# EAGLE design Atari ST 4MB RAM (EAGLE 7.7.0)
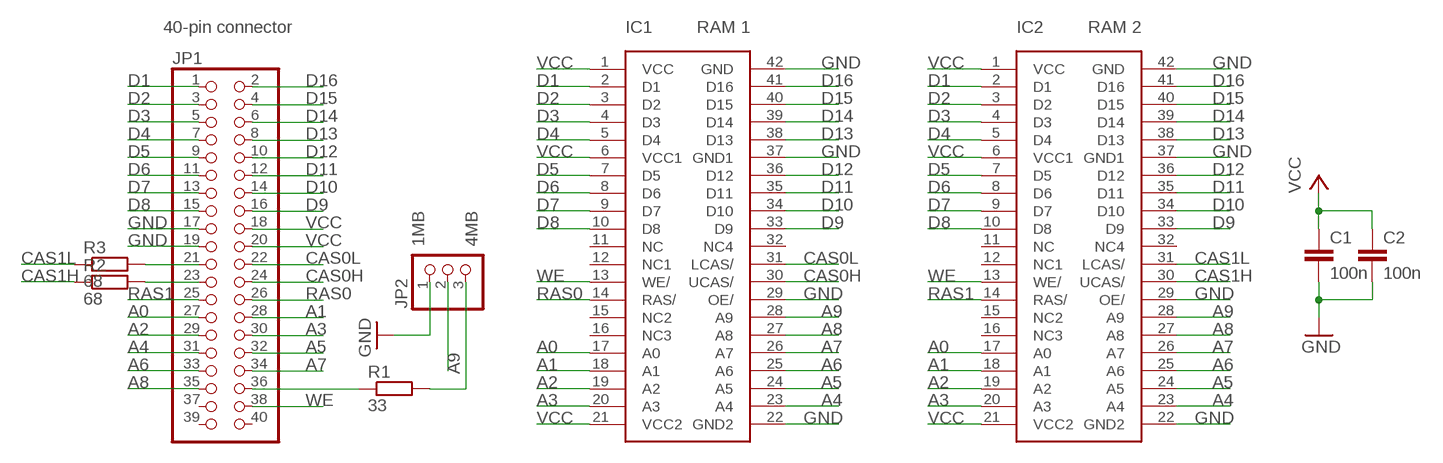
[diagram p0: schematic, sheet 1]

## Parts
C1  100n  C-EUC0805  [C0805]
C2  100n  C-EUC0805  [C0805]
IC1  DRAMSOJ40A  [SOJ40]
IC2  DRAMSOJ40A  [SOJ40]
JP1  PINHD-2X20  [2X20]
JP2  PINHD-1X3  [1X03]
R1  33  R-EU_R0805  [R0805]
R2  68  R-EU_R0805  [R0805]
R3  68  R-EU_R0805  [R0805]

## Nets
A0: IC1.17(A0) IC2.17(A0) JP1.27
A1: IC1.18(A1) IC2.18(A1) JP1.28
A2: IC1.19(A2) IC2.19(A2) JP1.29
A3: IC1.20(A3) IC2.20(A3) JP1.30
A4: IC1.23(A4) IC2.23(A4) JP1.31
A5: IC1.24(A5) IC2.24(A5) JP1.32
A6: IC1.25(A6) IC2.25(A6) JP1.33
A7: IC1.26(A7) IC2.26(A7) JP1.34
A8: IC1.27(A8) IC2.27(A8) JP1.35
A9: IC1.28(A9) IC2.28(A9) JP2.2
CAS0H: IC1.30(UCAS/) JP1.24
CAS0L: IC1.31(LCAS/) JP1.22
CAS1H: IC2.30(UCAS/) R2.1
CAS1L: IC2.31(LCAS/) R3.1
D1: IC1.2(D1) IC2.2(D1) JP1.1
D2: IC1.3(D2) IC2.3(D2) JP1.3
D3: IC1.4(D3) IC2.4(D3) JP1.5
D4: IC1.5(D4) IC2.5(D4) JP1.7
D5: IC1.7(D5) IC2.7(D5) JP1.9
D6: IC1.8(D6) IC2.8(D6) JP1.11
D7: IC1.9(D7) IC2.9(D7) JP1.13
D8: IC1.10(D8) IC2.10(D8) JP1.15
D9: IC1.33(D9) IC2.33(D9) JP1.16
D10: IC1.34(D10) IC2.34(D10) JP1.14
D11: IC1.35(D11) IC2.35(D11) JP1.12
D12: IC1.36(D12) IC2.36(D12) JP1.10
D13: IC1.38(D13) IC2.38(D13) JP1.8
D14: IC1.39(D14) IC2.39(D14) JP1.6
D15: IC1.40(D15) IC2.40(D15) JP1.4
D16: IC1.41(D16) IC2.41(D16) JP1.2
GND: C1.2 C2.2 IC1.22(GND2) IC1.29(OE/) IC1.37(GND1) IC1.42(GND) IC2.22(GND2) IC2.29(OE/) IC2.37(GND1) IC2.42(GND) JP1.17 JP1.19 JP2.1
N$1: JP1.21 R3.2
N$2: JP1.23 R2.2
N$3: JP1.36 R1.1
N$4: JP2.3 R1.2
RAS0: IC1.14(RAS/) JP1.26
RAS1: IC2.14(RAS/) JP1.25
VCC: C1.1 C2.1 IC1.1(VCC) IC1.6(VCC1) IC1.21(VCC2) IC2.1(VCC) IC2.6(VCC1) IC2.21(VCC2) JP1.18 JP1.20
WE: IC1.13(WE/) IC2.13(WE/) JP1.38
Unconnected: IC1.11(NC) IC1.12(NC1) IC1.15(NC2) IC1.16(NC3) IC1.32(NC4) IC2.11(NC) IC2.12(NC1) IC2.15(NC2) IC2.16(NC3) IC2.32(NC4) JP1.37 JP1.39 JP1.40

## Notes on the sheet
- 40-pin connector | RAM 1 | RAM 2
- 1MB | 4MB

## Library data of the parts
C1 C2 = rcl:C-EU: CAPACITOR, European symbol
IC1 IC2 = memory-soj42:DRAMSOJ40A: MEMORY; OC_FARNELL: unknown; OC_NEWARK: unknown
JP1 = pinhead:PINHD-2X20: PIN HEADER
JP2 = pinhead:PINHD-1X3: PIN HEADER
R1-R3 = rcl:R-EU_: RESISTOR, European symbol

## Board
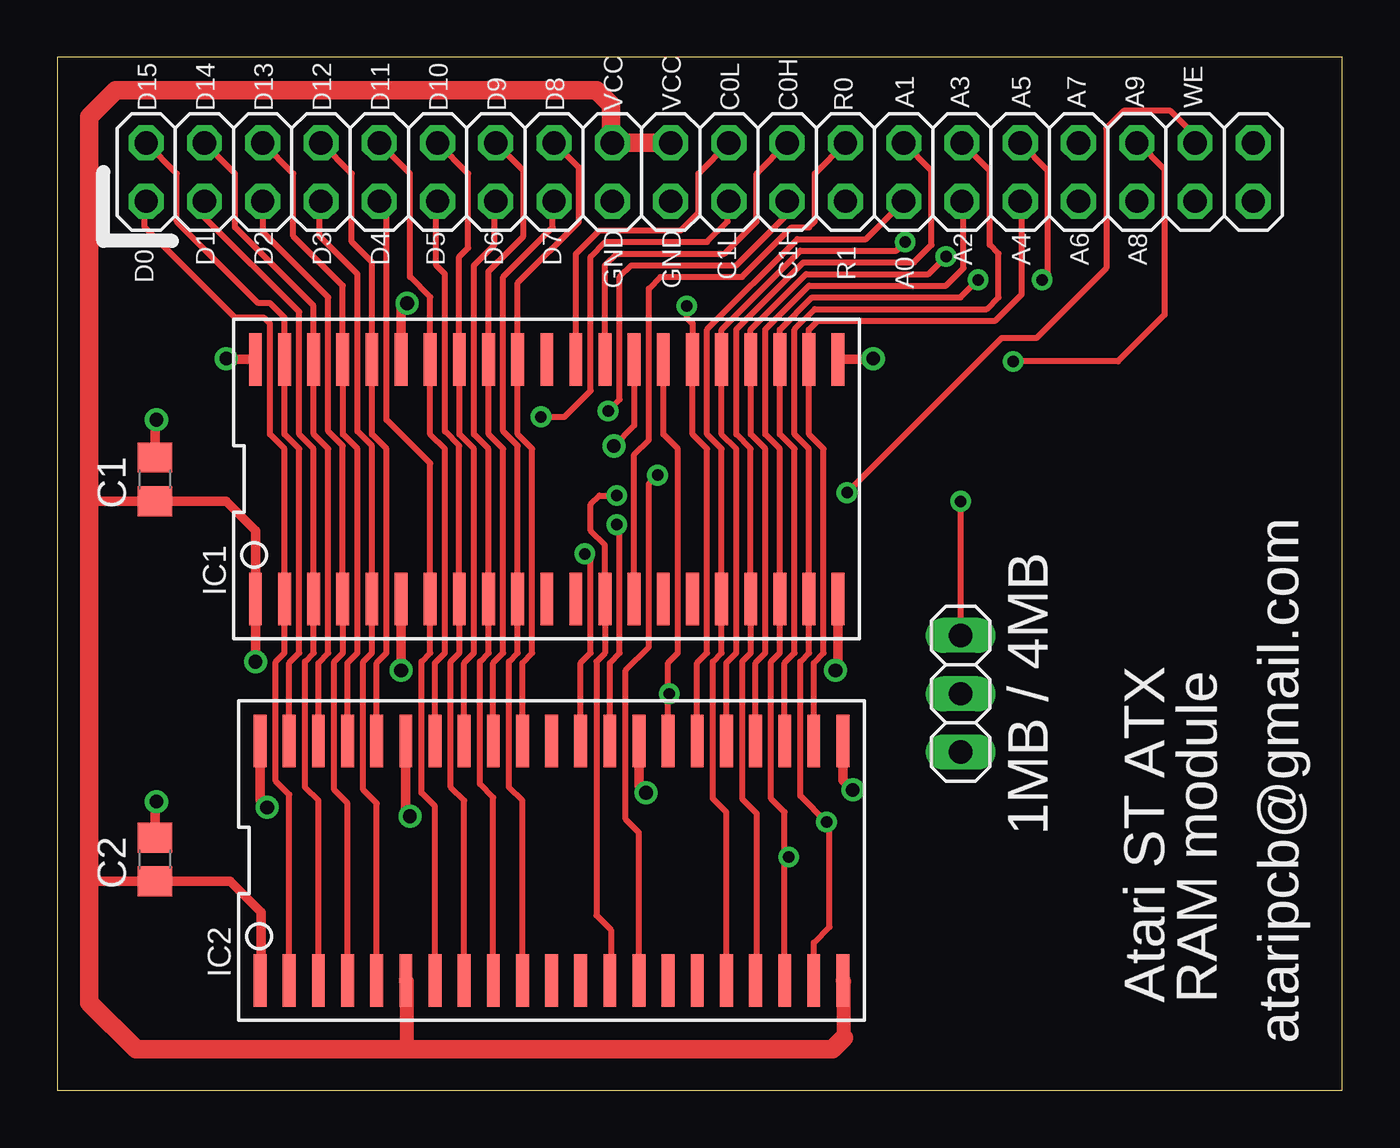
[diagram p1: board, top side]
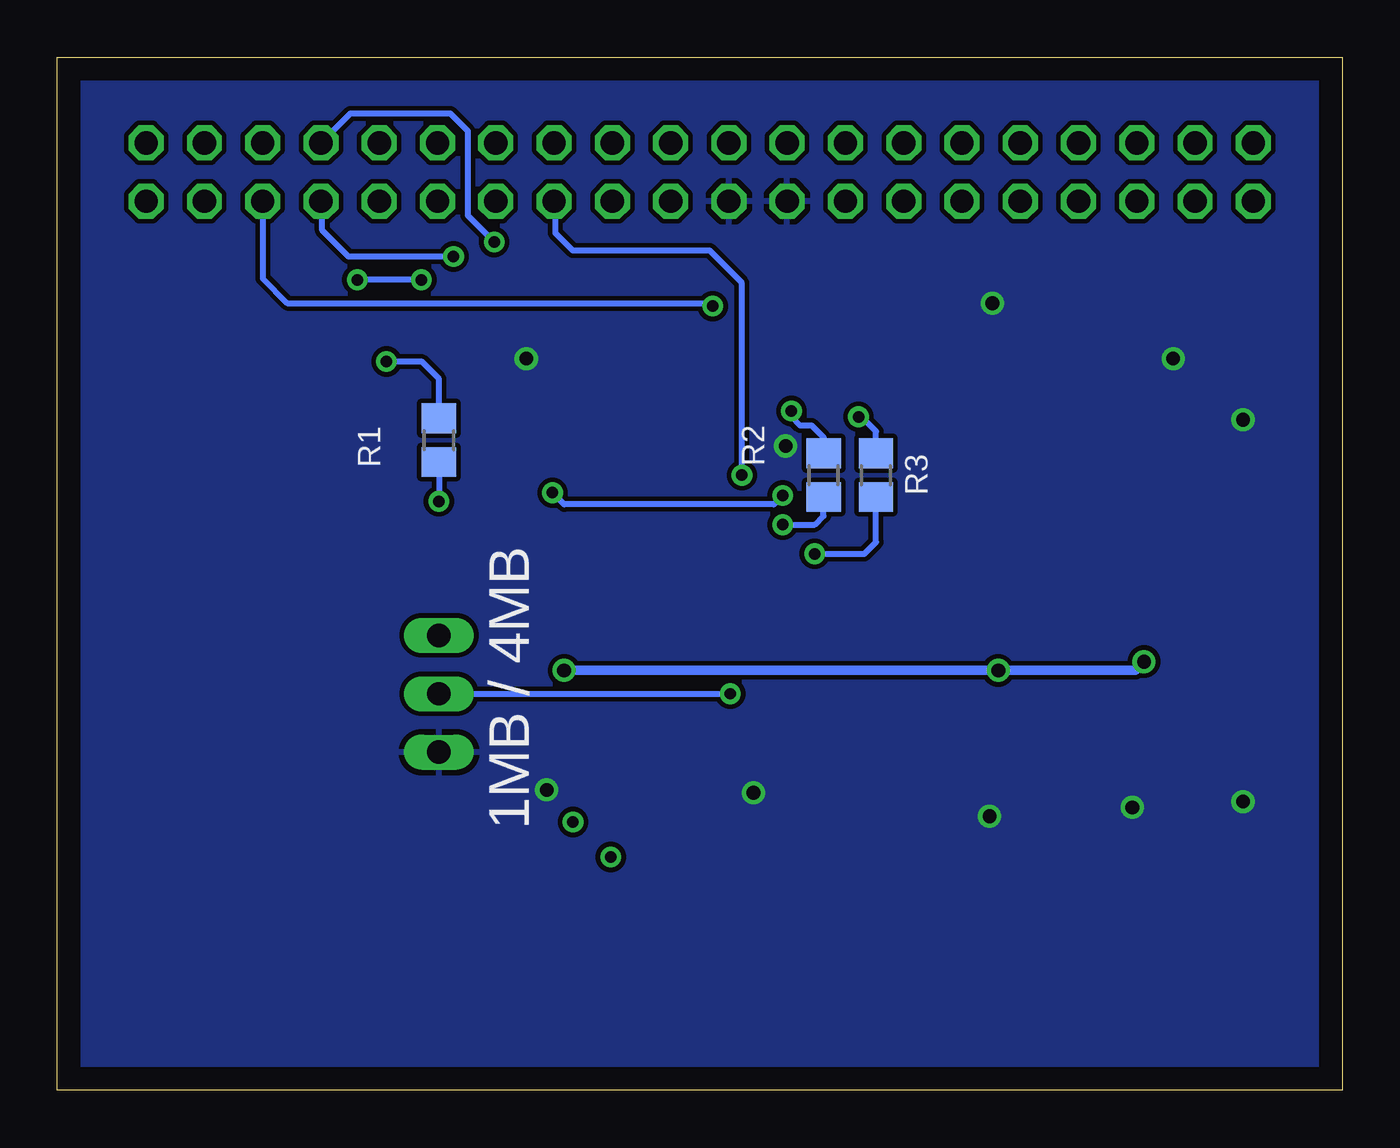
[diagram p2: board, bottom side, seen from below]

Size 56 x 45 mm. Coordinates in mm from the lower left corner, seen from the top.
Outline: 0,0 56,0 56,45 0,45 0,0
Copper layers (1*16): Top 0.035mm / dielectric 1.5mm / Bottom 0.035mm
Design rules "default": minimum track width 10mil, minimum drill 24mil, track to track 8mil, track to pad 8mil, pad to pad 8mil, via to via 8mil, smd to smd 8mil, copper to edge 40mil, drill to drill 8mil, minimum pad ring 10mil, minimum via ring 8mil, stop-mask expansion 4mil, vias tented up to drill 0mil, thermal gap 10mil

### Footprints (pad centres in the part's own frame; a part is rotated, then mirrored left to right if it is on the bottom)
C0805 = smd 1.3 x 1.5: 1 -0.95,0; 2 0.95,0
SOJ40 = smd 0.559 x 2.286: 1 -10.16,-5.22; 2 -8.89,-5.22; 3 -7.62,-5.22; 4 -6.35,-5.22; 5 -5.08,-5.22; 6 -3.81,-5.22; 7 -2.54,-5.22; 8 -1.27,-5.22; 9 0,-5.22; 10 1.27,-5.22; 11 2.54,-5.22; 12 3.81,-5.22; 13 5.08,-5.22; 14 6.35,-5.22; 15 7.62,-5.22; 16 8.89,-5.22; 17 10.16,-5.22; 18 11.43,-5.22; 19 12.7,-5.22; 20 13.97,-5.22; 21 15.24,-5.22; 22 15.24,5.22; 23 13.97,5.22; 24 12.7,5.22; 25 11.43,5.22; 26 10.16,5.22; 27 8.89,5.22; 28 7.62,5.22; 29 6.35,5.22; 30 5.08,5.22; 31 3.81,5.22; 32 2.54,5.22; 33 1.27,5.22; 34 0,5.22; 35 -1.27,5.22; 36 -2.54,5.22; 37 -3.81,5.22; 38 -5.08,5.22; 39 -6.35,5.22; 40 -7.62,5.22; 41 -8.89,5.22; 42 -10.16,5.22
2X20 = drill 1.016 octagon: 1 -24.13,-1.27; 2 -24.13,1.27; 3 -21.59,-1.27; 4 -21.59,1.27; 5 -19.05,-1.27; 6 -19.05,1.27; 7 -16.51,-1.27; 8 -16.51,1.27; 9 -13.97,-1.27; 10 -13.97,1.27; 11 -11.43,-1.27; 12 -11.43,1.27; 13 -8.89,-1.27; 14 -8.89,1.27; 15 -6.35,-1.27; 16 -6.35,1.27; 17 -3.81,-1.27; 18 -3.81,1.27; 19 -1.27,-1.27; 20 -1.27,1.27; 21 1.27,-1.27; 22 1.27,1.27; 23 3.81,-1.27; 24 3.81,1.27; 25 6.35,-1.27; 26 6.35,1.27; 27 8.89,-1.27; 28 8.89,1.27; 29 11.43,-1.27; 30 11.43,1.27; 31 13.97,-1.27; 32 13.97,1.27; 33 16.51,-1.27; 34 16.51,1.27; 35 19.05,-1.27; 36 19.05,1.27; 37 21.59,-1.27; 38 21.59,1.27; 39 24.13,-1.27; 40 24.13,1.27
1X03 = drill 1.016 long: 1 -2.54,0; 2 0,0; 3 2.54,0
R0805 = smd 1.3 x 1.5: 1 -0.95,0; 2 0.95,0

### Placement (x,y rotation side)
C1  4.26,26.61 90 top
C2  4.26,10.05 90 top
IC1  18.79,26.62 0 top
IC2  19,10 0 top
JP1  28,40 0 top
JP2  39.37,17.27 90 top
R1  39.37,28.32 270 bottom
R2  22.61,26.8 90 bottom
R3  20.32,26.8 90 bottom

### Tracks (layer width: path | path; a pad name or v marks a point on that pad's centre or on a via)
A0
  Top 0.254: IC2.17 29.16,12.12 28.57,12.7 28.57,18.67 28.96,19.05 IC1.17 28.95,27.95 28.32,28.57 28.32,33.15 32.26,37.08 35.24,37.08 JP1.27
A1
  Top 0.254: JP1.28 38.1,40.06 38.1,36.83 37.34,36.07 32.51,36.07 29.59,33.15 29.59,28.57 30.22,27.95 IC1.18 30.22,19.04 29.84,18.67 29.84,12.7 30.48,12.06 30.48,4.83 IC2.18
A2  (via drill 0.5)
  Top 0.254: IC2.19 31.7,10.16 | 31.7,10.16 31.7,12.12 31.11,12.7 31.11,18.67 31.5,19.05 IC1.19 31.49,27.95 30.86,28.57 30.86,33.15 32.77,35.05 38.73,35.05 39.5,35.81 39.5,38.66 JP1.29 | v31.88,10.16 31.7,10.16
A3  (via drill 0.5)
  Top 0.254: IC2.20 32.97,6.43 33.66,7.11 33.66,11.56 v33.53,11.68 32.38,12.83 32.38,18.67 32.77,19.05 IC1.20 32.76,27.95 32.13,28.57 32.13,33.15 33.02,34.04 40.51,34.04 41.02,34.54 41.02,36.45 40.64,36.83 40.64,40.06 JP1.30
A4
  Top 0.254: IC2.23 32.97,18.62 33.4,19.05 33.4,27.94 32.77,28.57 IC1.23 32.76,33.14 33.15,33.53 40.89,33.53 42.04,34.67 42.04,38.66 JP1.31
A5  (via drill 0.5)
  Top 0.254: IC2.24 31.7,18.62 32.13,19.05 32.13,27.94 31.5,28.57 IC1.24 31.49,33.14 32.89,34.54 39.37,34.54 v40.13,35.31 | v42.93,35.31 43.18,35.56 43.18,40.06 JP1.32
  Bottom 0.254: v40.13,35.31 v42.93,35.31
A6  (via drill 0.5)
  Top 0.254: IC2.25 30.43,18.62 30.86,19.05 30.86,27.94 30.23,28.57 IC1.25 30.22,33.14 32.64,35.56 37.97,35.56 v38.73,36.32
  Bottom 0.254: v38.73,36.32 43.31,36.32 44.45,37.47 44.45,38.67 JP1.33
A7  (via drill 0.5)
  Top 0.254: IC2.26 29.16,18.62 29.59,19.05 29.59,27.94 28.96,28.57 IC1.26 28.95,33.14 32.38,36.58 36.58,36.58 v36.96,36.96
  Bottom 0.254: v36.96,36.96 38.1,38.1 38.1,41.78 38.86,42.55 43.23,42.55 JP1.34
A8  (via drill 0.5)
  Top 0.254: IC2.27 27.89,18.62 28.32,19.05 28.32,27.94 27.69,28.57 IC1.27 27.69,33.4 27.43,33.66 v27.43,34.16
  Bottom 0.254: JP1.35 47.05,35.37 45.97,34.29 27.56,34.29 v27.43,34.16
A9  (via drill 0.5)
  Top 0.254: IC2.28 26.62,17.14 | 26.62,17.14 26.62,18.62 27.05,19.05 27.05,27.94 26.42,28.57 IC1.28 | v26.67,17.27 26.75,17.27 26.62,17.14
  Bottom 0.254: JP2.2 v26.67,17.27
CAS0H
  Top 0.254: IC1.30 23.87,35.94 24.38,36.45 29.08,36.45 30.48,37.85 30.48,39.94 JP1.24
CAS0L
  Top 0.254: IC1.31 22.6,36.44 23.62,37.47 27.18,37.47 27.94,38.23 27.94,39.94 JP1.22
CAS1H  (via drill 0.5)
  Top 0.254: IC2.30 24.08,18.62 24.51,19.05 24.51,24.51 v24.38,24.64
  Bottom 0.254: v24.38,24.64 22.99,24.64 22.61,25.02 R2.1
CAS1L  (via drill 0.5)
  Top 0.254: IC2.31 22.81,18.62 23.24,19.05 23.24,23.11 v22.99,23.37
  Bottom 0.254: v22.99,23.37 20.83,23.37 20.32,23.88 R3.1
D1
  Top 0.254: IC2.2 10.11,12.88 9.53,13.46 9.53,18.67 9.91,19.05 IC1.2 9.9,27.95 9.27,28.57 9.27,33.4 9.02,33.66 7.75,33.66 3.81,37.59 3.81,38.67 JP1.1
D2
  Top 0.254: IC2.3 11.38,12.62 10.79,13.21 10.79,18.67 11.18,19.05 IC1.3 11.17,27.95 10.54,28.57 10.54,33.91 6.41,38.04 JP1.3
D3
  Top 0.254: IC2.4 12.65,12.5 12.06,13.08 12.06,18.67 12.45,19.05 IC1.4 12.44,28.07 11.81,28.7 11.81,34.54 8.95,37.41 JP1.5
D4
  Top 0.254: IC2.5 13.92,12.5 13.34,13.08 13.34,18.67 13.72,19.05 IC1.5 13.71,28.07 13.08,28.7 13.08,35.56 11.43,37.21 11.43,38.79 JP1.7
D5
  Top 0.254: IC2.7 16.46,12.37 15.88,12.95 15.88,18.67 16.26,19.05 IC1.7 16.25,27.31 14.35,29.21 14.35,38.41 JP1.9
D6
  Top 0.254: IC2.8 17.73,12.62 17.14,13.21 17.14,18.67 17.53,19.05 IC1.8 17.52,28.07 16.89,28.7 16.89,35.56 16.51,35.94 16.51,38.67 JP1.11
D7
  Top 0.254: IC2.9 19,12.75 18.41,13.34 18.41,18.67 18.8,19.05 IC1.9 18.79,27.95 18.16,28.57 18.16,35.94 19.05,36.83 19.05,38.67 JP1.13
D8
  Top 0.254: IC2.10 20.27,12.62 19.68,13.21 19.68,18.67 20.07,19.05 IC1.10 20.06,28.07 19.43,28.7 19.43,35.43 21.59,37.59 21.59,38.67 JP1.15
D9
  Top 0.254: IC2.33 20.27,18.62 20.7,19.05 20.7,27.94 20.07,28.57 IC1.33 20.06,35.17 22.73,37.85 22.73,40.19 JP1.16
D10
  Top 0.254: IC2.34 19,18.62 19.43,19.05 19.43,27.94 18.8,28.57 IC1.34 18.79,35.68 20.32,37.21 20.32,40.06 JP1.14
D11
  Top 0.254: IC2.35 17.73,18.62 18.16,19.05 18.16,27.94 17.53,28.57 IC1.35 17.52,36.32 17.91,36.7 17.91,39.93 JP1.12
D12
  Top 0.254: IC2.36 16.46,18.62 16.89,19.05 16.89,27.94 16.26,28.57 IC1.36 16.25,34.55 15.37,35.43 15.37,39.93 JP1.10
D13
  Top 0.254: IC2.38 13.92,18.62 14.35,19.05 14.35,27.94 13.72,28.57 IC1.38 13.71,36.07 12.83,36.96 12.83,39.93 JP1.8
D14
  Top 0.254: IC2.39 12.65,18.62 13.08,19.05 13.08,27.94 12.45,28.57 IC1.39 12.44,35.06 10.29,37.21 10.29,39.93 JP1.6
D15
  Top 0.254: IC2.40 11.38,18.62 11.81,19.05 11.81,27.94 11.18,28.57 IC1.40 11.17,34.17 7.75,37.59 7.75,39.93 JP1.4
D16
  Top 0.254: IC2.41 10.11,18.62 10.54,19.05 10.54,27.94 9.91,28.57 IC1.41 9.9,33.66 9.27,34.29 8.76,34.29 5.21,37.85 5.21,39.93 JP1.2
GND  (via drill 0.6)
  Top 0.254: IC1.29 25.14,28.95 v24.26,28.07
  Top 0.406: IC1.37 14.98,34.03 v15.24,34.29 | IC1.42 7.4,31.84 v7.37,31.88 | C1.2 4.26,29.15 v4.32,29.21 | IC1.22 35.52,31.84 v35.56,31.88 | IC2.22 34.24,13.51 v34.67,13.08 | IC2.29 25.35,13.26 v25.65,12.95 | IC2.37 15.19,12.12 v15.37,11.94 | IC2.42 8.84,12.62 v9.14,12.32 | C2.2 4.26,12.51 v4.32,12.57
  pour Bottom: 0,44.96 56.01,44.96 56.01,0 0,0
N$1  (via drill 0.5)
  Top 0.254: JP1.21 29.21,38.67 29.21,37.85 28.32,36.96 23.88,36.96 23.24,36.32 23.24,30.48 22.1,29.34 v21.08,29.34
  Bottom 0.254: R3.2 20.32,28.7 20.95,29.34 v21.08,29.34
N$2  (via drill 0.5)
  Top 0.254: v24,29.59 24.51,30.1 24.51,35.43 25.02,35.94 29.59,35.94 31.75,38.1 31.75,38.28 JP1.23
  Bottom 0.254: R2.2 22.61,28.45 23.11,28.96 23.62,28.96 24,29.34 v24,29.59
N$3  (via drill 0.5)
  Top 0.254: JP1.36 47.12,41.27 48.26,40.13 48.26,33.78 46.23,31.75 v41.66,31.75
  Bottom 0.254: R1.1 39.37,30.99 40.13,31.75 v41.66,31.75
N$4  (via drill 0.5)
  Top 0.254: v39.37,25.65 JP2.3
  Bottom 0.254: R1.2 v39.37,25.65
RAS0
  Top 0.254: IC1.14 25.14,27.69 25.78,28.32 25.78,34.92 26.29,35.43 29.84,35.43 32,37.59 32.77,37.59 33.02,37.85 33.02,39.94 JP1.26
RAS1  (via drill 0.5)
  Top 0.254: IC2.14 25.35,11.23 24.77,11.81 24.77,18.29 25.78,19.3 25.78,26.42 v26.16,26.8
  Bottom 0.254: v26.16,26.8 26.16,35.18 27.56,36.58 33.53,36.58 34.29,37.34 34.29,38.67 JP1.25
VCC  (via drill 0.6)
  Top 0.406: IC1.1 8.64,24.38 7.36,25.66 C1.1 2.68,25.66 2.67,25.65 1.4,25.65 | IC1.1 | IC1.21 34.03,18.41 v33.91,18.29 | IC1.1 v8.64,18.67 | IC1.6 14.98,18.93 v14.99,18.29 | 1.4,9.02 1.48,9.1 C2.1 7.54,9.1 8.89,7.75 8.89,4.83 IC2.1
  Top 0.61: 15.24,1.78 15.24,4.73 IC2.6 | 34.29,2.29 34.29,4.73 IC2.21
  Top 0.813: JP1.20 JP1.18 24.13,41.33 24.13,42.93 23.5,43.56 2.54,43.56 1.4,42.42 1.4,25.65 1.4,9.02 1.4,3.81 3.43,1.78 15.24,1.78 33.78,1.78 34.29,2.29
  Bottom 0.406: v33.91,18.29 14.86,18.29 | 14.86,18.29 9.02,18.29 v8.64,18.67 | v14.99,18.29 14.99,18.41 14.86,18.29
WE  (via drill 0.5)
  Top 0.254: IC2.13 24.13,4.83 24.13,6.99 23.5,7.62 23.5,18.67 23.87,19.04 IC1.13 23.87,23.75 23.24,24.38 23.24,25.53 23.62,25.91 v24.38,25.91 | JP1.38 49.59,41.6 48.51,42.67 46.48,42.67 45.72,41.91 45.72,35.81 42.67,32.77 41.15,32.77 v34.42,26.04
  Bottom 0.254: v24.38,25.91 24.77,25.53 33.91,25.53 v34.42,26.04

### Text on the board
tNames: D15 | D14 | D13 | D12 | D11 | D10 | D9 | D8 | VCC | VCC | C0L | C0H | R0 | A1 | A3 | A5 | A7 | A9 | WE | D1 | D2 | D3 | D4 | D5 | D6 | D7 | A2 | A4 | A6 | A8 | D0 | GND | GND | C1L | C1H | R1 | A0 | 1MB / 4MB | Atari ST ATX | RAM module | ataripcb@gmail.com
bNames: 1MB / 4MB